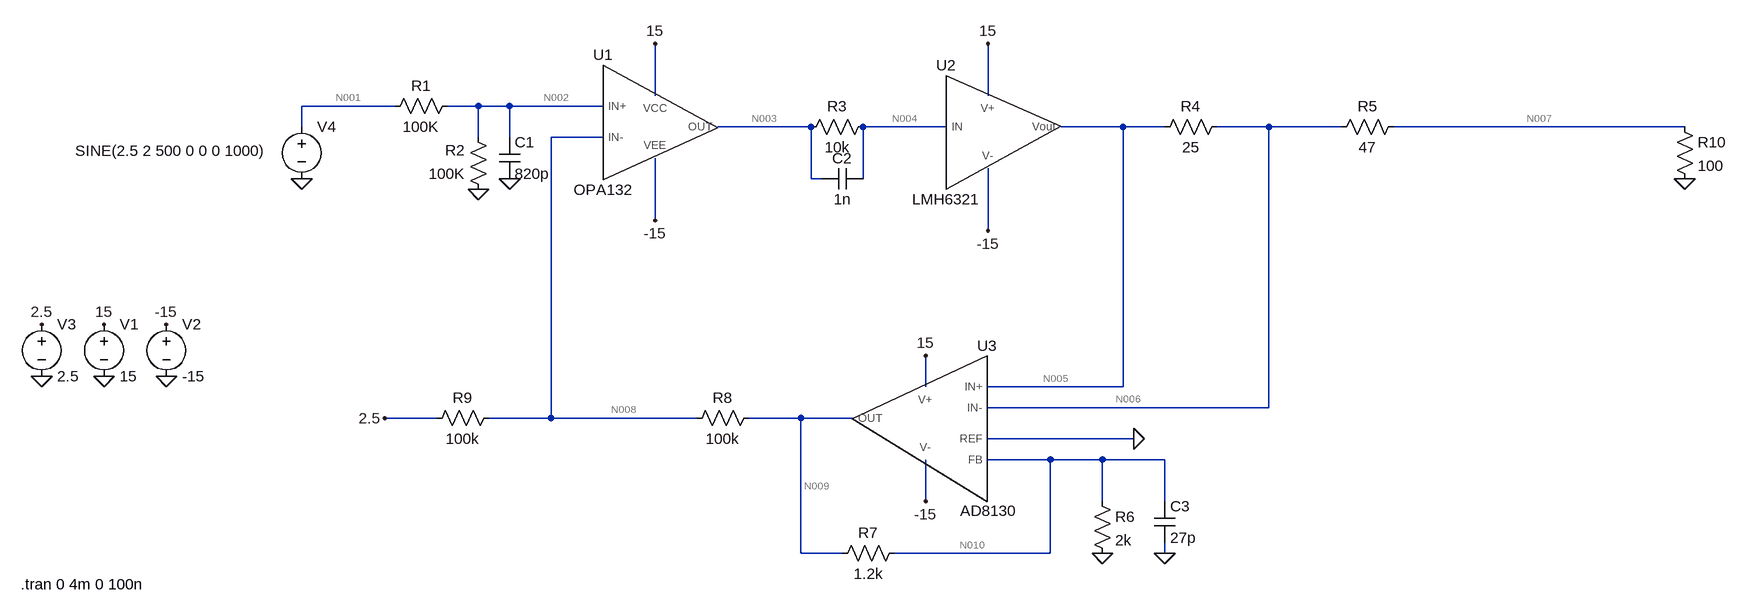
[diagram p0: schematic current_driver_time.asc]
current_driver_time.asc, the LTspice schematic file:
Version 4
SHEET 1 2244 900
WIRE 592 128 592 48
WIRE 1104 128 1104 48
WIRE 192 144 48 144
WIRE 320 144 272 144
WIRE 368 144 320 144
WIRE 512 144 368 144
WIRE 48 176 48 144
WIRE 832 176 688 176
WIRE 1040 176 912 176
WIRE 1312 176 1216 176
WIRE 1376 176 1312 176
WIRE 1536 176 1456 176
WIRE 1648 176 1536 176
WIRE 2176 176 1728 176
WIRE 320 192 320 144
WIRE 368 192 368 144
WIRE 512 192 432 192
WIRE 832 256 832 176
WIRE 848 256 832 256
WIRE 912 256 912 176
WIRE 592 320 592 224
WIRE 1104 336 1104 240
WIRE 1008 576 1008 528
WIRE 1312 576 1312 176
WIRE 1312 576 1104 576
WIRE 1536 608 1536 176
WIRE 1536 608 1104 608
WIRE 256 624 176 624
WIRE 432 624 432 192
WIRE 432 624 336 624
WIRE 656 624 432 624
WIRE 816 624 736 624
WIRE 896 624 816 624
WIRE 1328 656 1104 656
WIRE 1200 688 1104 688
WIRE 1280 688 1200 688
WIRE 1376 688 1280 688
WIRE 1008 752 1008 688
WIRE 1280 752 1280 688
WIRE 1376 752 1376 688
WIRE 816 832 816 624
WIRE 880 832 816 832
WIRE 1200 832 1200 688
WIRE 1200 832 960 832
WIRE 1376 832 1376 816
FLAG 320 272 0
FLAG 368 256 0
FLAG -256 560 0
FLAG -160 560 0
FLAG -256 480 15
FLAG -160 480 -15
FLAG 592 48 15
FLAG 592 320 -15
FLAG 1104 48 15
FLAG 1104 336 -15
FLAG 1328 656 0
FLAG 1280 832 0
FLAG 1376 832 0
FLAG -352 560 0
FLAG -352 480 2.5
FLAG 176 624 2.5
FLAG 2176 256 0
FLAG 48 256 0
FLAG 1008 528 15
FLAG 1008 752 -15
SYMBOL res 288 128 R90
WINDOW 0 0 56 VBottom 2
WINDOW 3 32 56 VTop 2
SYMATTR InstName R1
SYMATTR Value 100K
SYMBOL res 336 288 R180
WINDOW 0 36 76 Left 2
WINDOW 3 36 40 Left 2
SYMATTR InstName R2
SYMATTR Value 100K
SYMBOL cap 352 192 R0
SYMATTR InstName C1
SYMATTR Value 820p
SYMBOL voltage -256 464 R0
WINDOW 123 0 0 Left 2
WINDOW 39 0 0 Left 2
SYMATTR InstName V1
SYMATTR Value 15
SYMBOL voltage -160 464 R0
WINDOW 123 0 0 Left 2
WINDOW 39 0 0 Left 2
SYMATTR InstName V2
SYMATTR Value -15
SYMBOL res 928 160 R90
WINDOW 0 0 56 VBottom 2
WINDOW 3 32 56 VTop 2
SYMATTR InstName R3
SYMATTR Value 10k
SYMBOL cap 912 240 R90
WINDOW 0 0 32 VBottom 2
WINDOW 3 32 32 VTop 2
SYMATTR InstName C2
SYMATTR Value 1n
SYMBOL AutoGenerated\\OPA132 592 160 R0
SYMATTR InstName U1
SYMBOL AutoGenerated\\LMH6321 1104 176 R0
SYMATTR InstName U2
SYMBOL res 1472 160 R90
WINDOW 0 0 56 VBottom 2
WINDOW 3 32 56 VTop 2
SYMATTR InstName R4
SYMATTR Value 25
SYMBOL res 1744 160 R90
WINDOW 0 0 56 VBottom 2
WINDOW 3 32 56 VTop 2
SYMATTR InstName R5
SYMATTR Value 47
SYMBOL AutoGenerated\\AD8130 1072 640 M0
SYMATTR InstName U3
SYMBOL res 1264 736 R0
SYMATTR InstName R6
SYMATTR Value 2k
SYMBOL cap 1360 752 R0
SYMATTR InstName C3
SYMATTR Value 27p
SYMBOL res 976 816 R90
WINDOW 0 0 56 VBottom 2
WINDOW 3 32 56 VTop 2
SYMATTR InstName R7
SYMATTR Value 1.2k
SYMBOL res 752 608 R90
WINDOW 0 0 56 VBottom 2
WINDOW 3 32 56 VTop 2
SYMATTR InstName R8
SYMATTR Value 100k
SYMBOL res 352 608 R90
WINDOW 0 0 56 VBottom 2
WINDOW 3 32 56 VTop 2
SYMATTR InstName R9
SYMATTR Value 100k
SYMBOL voltage -352 464 R0
WINDOW 123 0 0 Left 2
WINDOW 39 0 0 Left 2
SYMATTR InstName V3
SYMATTR Value 2.5
SYMBOL res 2160 160 R0
SYMATTR InstName R10
SYMATTR Value 100
SYMBOL voltage 48 160 R0
WINDOW 3 -348 53 Left 2
WINDOW 123 0 0 Left 2
WINDOW 39 0 0 Left 2
SYMATTR Value SINE(2.5 2 500 0 0 0 1000)
SYMATTR InstName V4
TEXT -384 880 Left 2 !.tran 0 4m 0 100n

The netlist it stands for:
* current_driver_time.asc
R1 N002 N001 100K
R2 0 N002 100K
C1 N002 0 820p
V1 15 0 15
V2 -15 0 -15
R3 N004 N003 10k
C2 N004 N003 1n
XU1 N002 N008 15 -15 N003 OPA132  ; pins IN+ IN- VCC VEE OUT
XU2 N004 15 -15 N005 LMH6321  ; pins IN V+ V- Vout
R4 N006 N005 25
R5 N007 N006 47
XU3 N005 N006 0 N010 15 -15 N009 AD8130  ; pins IN+ IN- REF FB V+ V- OUT
R6 N010 0 2k
C3 N010 0 27p
R7 N010 N009 1.2k
R8 N009 N008 100k
R9 N008 2.5 100k
V3 2.5 0 2.5
R10 N007 0 100
V4 N001 0 SINE(2.5 2 500 0 0 0 1000)
.tran 0 4m 0 100n
.lib C:\Users\Jorge\Desktop\OPA132.LIB
.lib C:\Users\Jorge\Desktop\LMH6321.MOD
.lib C:\Users\Jorge\Desktop\ad8130.cir
.backanno
.end

* Results of the author's LTspice run, read from the files saved beside the schematic
* Operating Point, zero values left out:
*   V(n002) = 1.25 V
*   V(n001) = 2.5 V
*   V(15) = 15 V
*   V(-15) = -15 V
*   V(n004) = -19.97 mV
*   V(n003) = -35.41 mV
*   V(n008) = 1.25 V
*   V(n005) = -23.18 mV
*   V(n006) = -19.82 mV
*   V(n007) = -13.48 mV
*   V(n010) = -360.5 µV
*   V(n009) = 524.8 µV
*   V(2.5) = 2.5 V
*   I(R10) = -134.8 µA
*   I(R9) = -12.5 µA
*   I(R8) = -12.5 µA
*   I(R7) = -737.7 nA
*   I(R6) = -180.2 nA
*   I(R5) = 134.8 µA
*   I(R4) = 134.4 µA
*   I(R3) = 1.544 µA
*   I(R2) = -12.5 µA
*   I(R1) = -12.5 µA
*   I(V4) = -12.5 µA
*   I(V3) = -12.5 µA
*   I(V2) = 28.43 mA
*   I(V1) = -28.28 mA
*   Ix(u1:IN+) = 11.35 pA
*   Ix(u1:IN-) = 9.259 pA
*   Ix(u1:VCC) = 4 mA
*   Ix(u1:VEE) = -4.002 mA
*   Ix(u1:OUT) = 1.544 µA
*   Ix(u2:3) = -1.544 µA
*   Ix(u2:77) = 9.789 mA
*   Ix(u2:44) = -9.922 mA
*   Ix(u2:6) = 133.8 µA
*   Ix(u3:1) = 578.8 nA
*   Ix(u3:2) = 420.7 nA
*   Ix(u3:3) = 1.08 µA
*   Ix(u3:4) = 918 nA
*   Ix(u3:99) = 14.49 mA
*   Ix(u3:50) = -14.51 mA
*   Ix(u3:45) = 11.76 µA
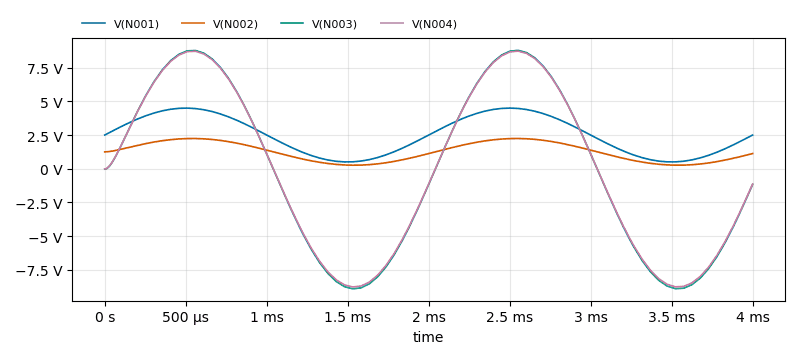
[diagram p1: Transient Analysis of current_driver_time.asc, plotted from the saved traces]
* Transient Analysis, 1 run:
*   V(N001): min 503.7 mV, max 4.5 V, average 2.5 V, rms 2.872 V, last 2.5 V
*   V(N002): min 258.7 mV, max 2.241 V, average 1.251 V, rms 1.434 V, last 1.122 V
*   V(N003): min -8.92 V, max 8.787 V, average -38.51 mV, rms 6.257 V, last -1.17 V
*   V(N004): min -8.785 V, max 8.729 V, average -11.41 mV, rms 6.19 V, last -1.141 V